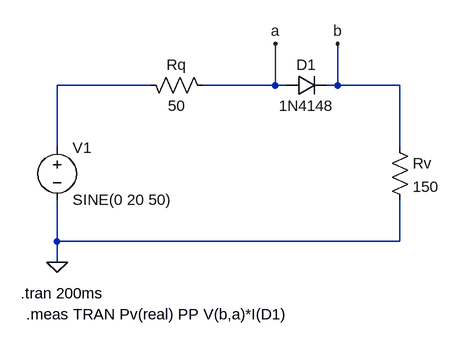
[diagram p0: schematic Diode.asc]
Diode.asc, the LTspice schematic file:
Version 4
SHEET 1 1268 680
WIRE 240 32 96 32
WIRE 432 32 432 -32
WIRE 432 32 320 32
WIRE 448 32 432 32
WIRE 528 32 528 -32
WIRE 528 32 512 32
WIRE 624 32 528 32
WIRE 96 128 96 32
WIRE 624 128 624 32
WIRE 96 272 96 208
WIRE 624 272 624 208
WIRE 624 272 96 272
WIRE 96 304 96 272
FLAG 96 304 0
FLAG 432 -32 a
FLAG 528 -32 b
SYMBOL res 224 16 M90
WINDOW 0 0 56 VBottom 2
WINDOW 3 32 56 VTop 2
SYMATTR InstName Rq
SYMATTR Value 50
SYMBOL diode 448 48 R270
WINDOW 0 32 32 VTop 2
WINDOW 3 0 32 VBottom 2
SYMATTR InstName D1
SYMATTR Value 1N4148
SYMBOL res 608 112 R0
SYMATTR InstName Rv
SYMATTR Value 150
SYMBOL LTspice_EuroComponents\\voltage 96 112 R0
WINDOW 123 0 0 Left 0
WINDOW 39 0 0 Left 0
SYMATTR InstName V1
SYMATTR Value SINE(0 20 50)
TEXT 40 352 Left 2 !.tran 200ms
TEXT 48 384 Left 2 !.meas TRAN Pv(real) PP V(b,a)*I(D1)

The netlist it stands for:
* Diode.asc
Rq N001 a 50
D1 a b 1N4148
Rv b 0 150
V1 N001 0 SINE(0 20 50)
.model D D
.lib standard.dio
.tran 200ms
.meas TRAN Pv(real) PP V(b,a)*I(D1)
.backanno
.end